# EAGLE schematic circuit_v2 (EAGLE 9.5.2)
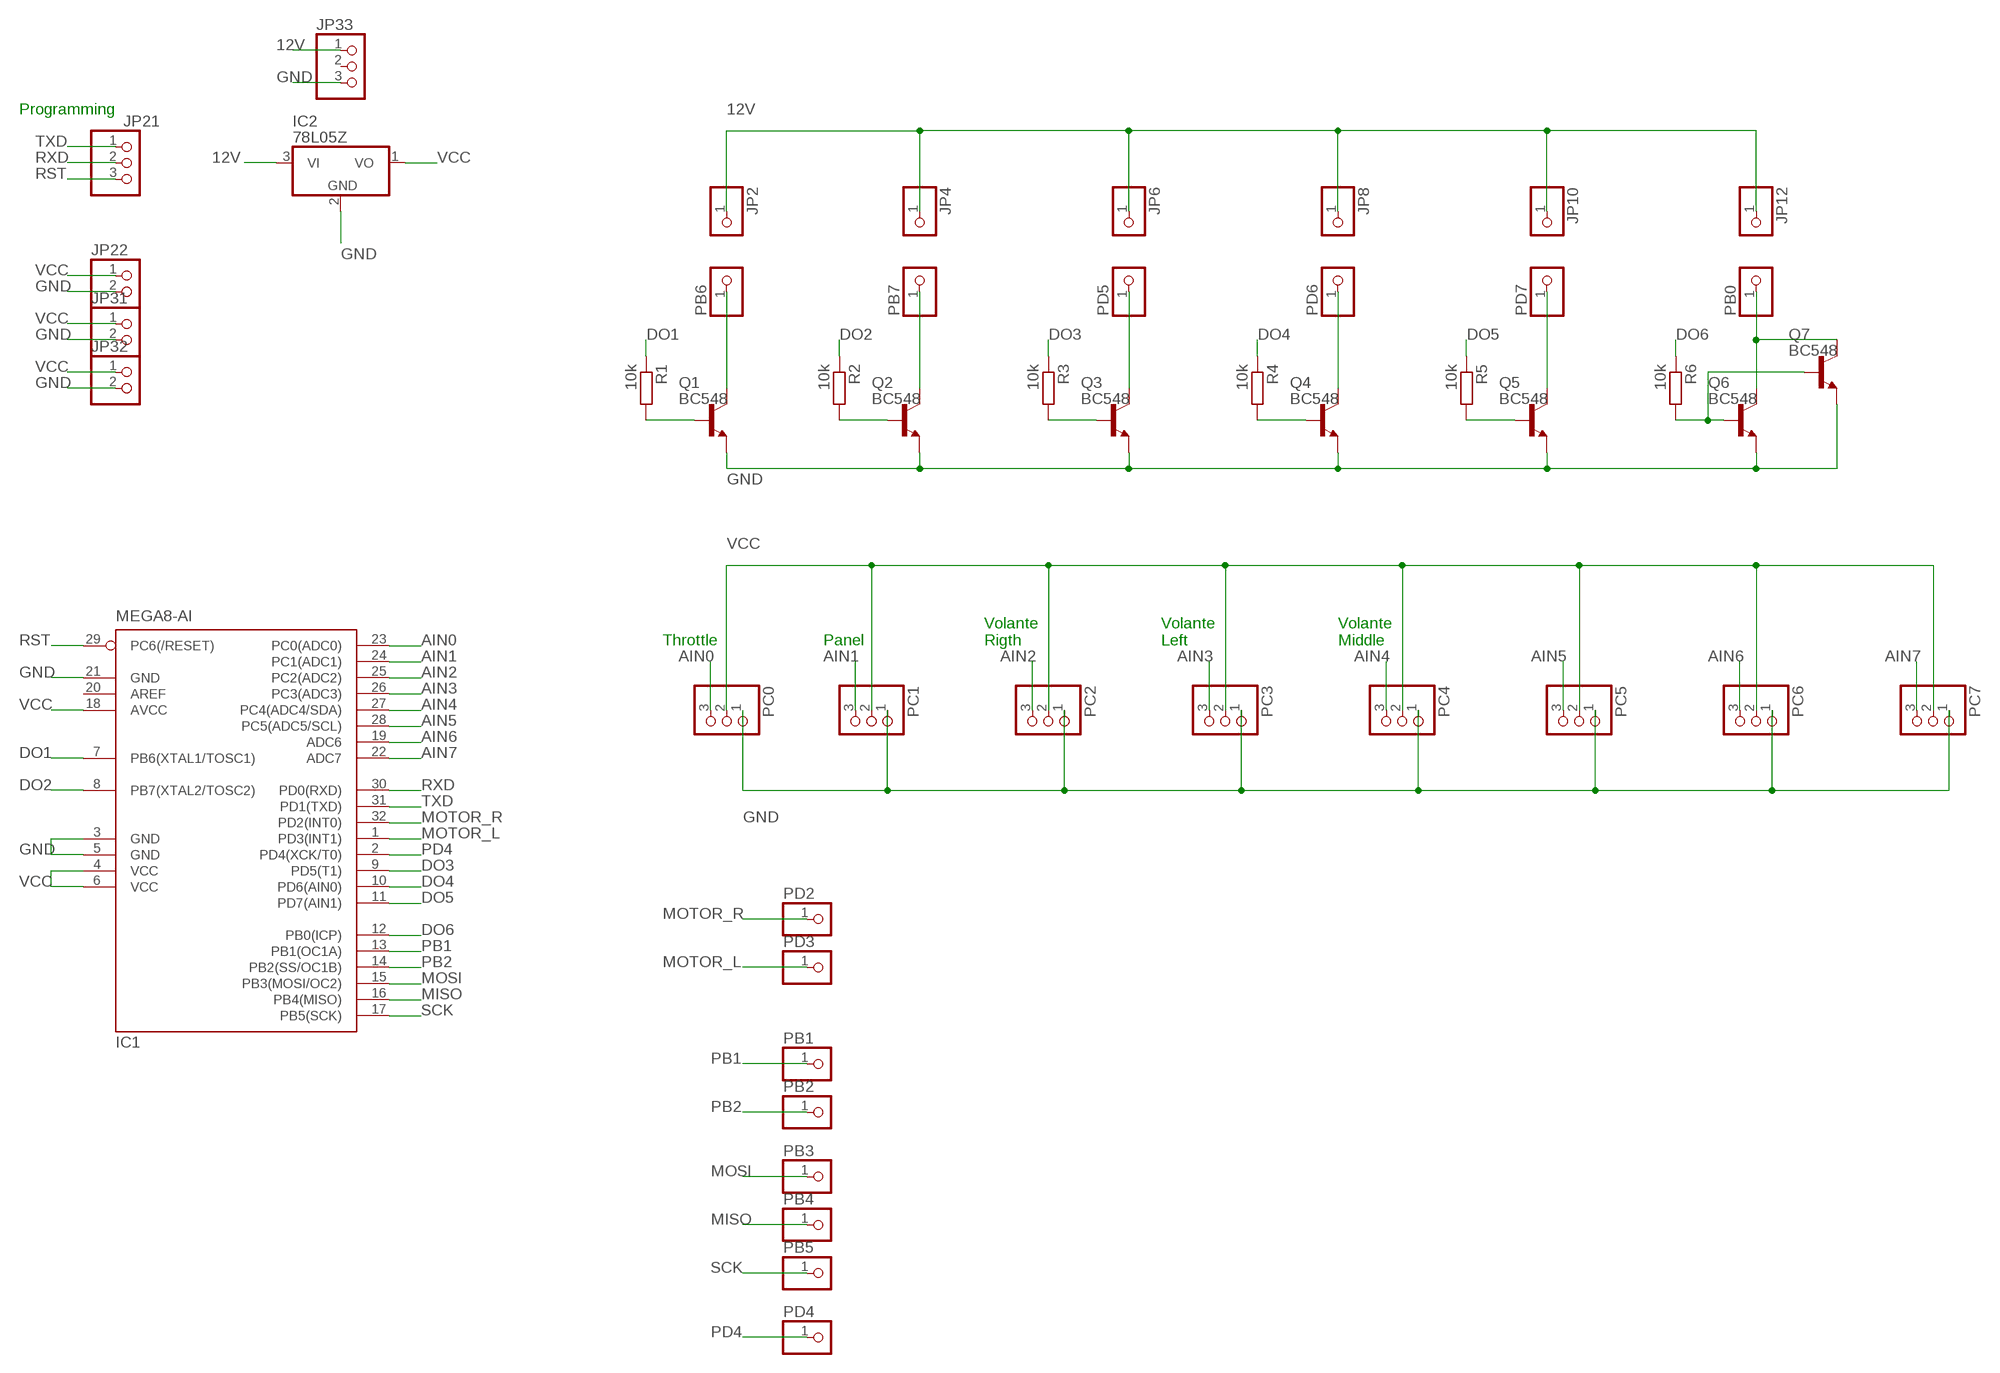
[diagram p0: schematic, sheet 1]

## Parts
IC1  MEGA8-AI  [TQFP32-08]
IC2  78L05Z  [TO92]
JP2  PINHD-1X1  [1X01]
JP4  PINHD-1X1  [1X01]
JP6  PINHD-1X1  [1X01]
JP8  PINHD-1X1  [1X01]
JP10  PINHD-1X1  [1X01]
JP12  PINHD-1X1  [1X01]
JP21  PINHD-1X3  [1X03]
JP22  PINHD-1X2  [1X02]
JP31  PINHD-1X2  [1X02]
JP32  PINHD-1X2  [1X02]
JP33  PINHD-1X3  [1X03]
PB0  PINHD-1X1  [1X01]
PB1  PINHD-1X1  [1X01]
PB2  PINHD-1X1  [1X01]
PB3  PINHD-1X1  [1X01]
PB4  PINHD-1X1  [1X01]
PB5  PINHD-1X1  [1X01]
PB6  PINHD-1X1  [1X01]
PB7  PINHD-1X1  [1X01]
PC0  PINHD-1X3  [1X03]
PC1  PINHD-1X3  [1X03]
PC2  PINHD-1X3  [1X03]
PC3  PINHD-1X3  [1X03]
PC4  PINHD-1X3  [1X03]
PC5  PINHD-1X3  [1X03]
PC6  PINHD-1X3  [1X03]
PC7  PINHD-1X3  [1X03]
PD2  PINHD-1X1  [1X01]
PD3  PINHD-1X1  [1X01]
PD4  PINHD-1X1  [1X01]
PD5  PINHD-1X1  [1X01]
PD6  PINHD-1X1  [1X01]
PD7  PINHD-1X1  [1X01]
Q1  BC548  [TO92-EBC]
Q2  BC548  [TO92-EBC]
Q3  BC548  [TO92-EBC]
Q4  BC548  [TO92-EBC]
Q5  BC548  [TO92-EBC]
Q6  BC548  [TO92-EBC]
Q7  BC548  [TO92-EBC]
R1  10k  R-EU_0207/10  [0207/10]
R2  10k  R-EU_0207/10  [0207/10]
R3  10k  R-EU_0207/10  [0207/10]
R4  10k  R-EU_0207/10  [0207/10]
R5  10k  R-EU_0207/10  [0207/10]
R6  10k  R-EU_0207/10  [0207/10]

## Nets
12V: IC2.3(VI) JP2.1 JP4.1 JP6.1 JP8.1 JP10.1 JP12.1 JP33.1
AIN0: IC1.23(PC0(ADC0)) PC0.3
AIN1: IC1.24(PC1(ADC1)) PC1.3
AIN2: IC1.25(PC2(ADC2)) PC2.3
AIN3: IC1.26(PC3(ADC3)) PC3.3
AIN4: IC1.27(PC4(ADC4/SDA)) PC4.3
AIN5: IC1.28(PC5(ADC5/SCL)) PC5.3
AIN6: IC1.19(ADC6) PC6.3
AIN7: IC1.22(ADC7) PC7.3
DO1: IC1.7(PB6(XTAL1/TOSC1)) R1.1
DO2: IC1.8(PB7(XTAL2/TOSC2)) R2.1
DO3: IC1.9(PD5(T1)) R3.1
DO4: IC1.10(PD6(AIN0)) R4.1
DO5: IC1.11(PD7(AIN1)) R5.1
DO6: IC1.12(PB0(ICP)) R6.1
GND: IC1.3(GND) IC1.5(GND) IC1.21(GND) IC2.2(GND) JP22.2 JP31.2 JP32.2 JP33.3 PC0.1 PC1.1 PC2.1 PC3.1 PC4.1 PC5.1 PC6.1 PC7.1 Q1.E Q2.E Q3.E Q4.E Q5.E Q6.E Q7.E
MISO: IC1.16(PB4(MISO)) PB4.1
MOSI: IC1.15(PB3(MOSI/OC2)) PB3.1
MOTOR_L: IC1.1(PD3(INT1)) PD3.1
MOTOR_R: IC1.32(PD2(INT0)) PD2.1
N$1: Q1.B R1.2
N$2: Q2.B R2.2
N$3: Q3.B R3.2
N$4: Q4.B R4.2
N$5: Q5.B R5.2
N$6: Q6.B Q7.B R6.2
OUT1: PB6.1 Q1.C
OUT2: PB7.1 Q2.C
OUT3: PD5.1 Q3.C
OUT4: PD6.1 Q4.C
OUT5: PD7.1 Q5.C
OUT6: PB0.1 Q6.C Q7.C
PB1: IC1.13(PB1(OC1A)) PB1.1
PB2: IC1.14(PB2(SS/OC1B)) PB2.1
PD4: IC1.2(PD4(XCK/T0)) PD4.1
RST: IC1.29(PC6(/RESET)) JP21.3
RXD: IC1.30(PD0(RXD)) JP21.2
SCK: IC1.17(PB5(SCK)) PB5.1
TXD: IC1.31(PD1(TXD)) JP21.1
VCC: IC1.4(VCC) IC1.6(VCC) IC1.18(AVCC) IC2.1(VO) JP22.1 JP31.1 JP32.1 PC0.2 PC1.2 PC2.2 PC3.2 PC4.2 PC5.2 PC6.2 PC7.2
Unconnected: IC1.20(AREF) JP33.2

## Notes on the sheet
- Programming
- Throttle | Panel
- Volante
  Rigth
- Volante
  Left
- Volante
  Middle

## Library data of the parts
IC1 = atmel:MEGA8: MICROCONTROLLER 8 Kbytes FLASH, 1 kbytes SRAM, 512 bytes EEPROM, USART, 6-channel 10 bit ADC, 2-channel 8 bit ADC Pin compatible with Atmega48, ATMega88, ATMega168 Source: avr.lbr; MPN: ATMEGA8-16AU; OC_FARNELL: 9171371; OC_NEWARK: 73M8863
IC2 = linear:78*: Positive VOLTAGE REGULATOR Source: http://cache.national.com/ds/LM/LM78L05.pdf http://www.fairchildsemi.com/ds/LM/LM7805.pdf
JP2 JP4 JP6 JP8 JP10 JP12 PB0 PB1-PB7 PD2-PD7 = pinhead:PINHD-1X1: PIN HEADER
JP21 JP33 PC0 PC1-PC7 = pinhead:PINHD-1X3: PIN HEADER
JP22 JP31 JP32 = pinhead:PINHD-1X2: PIN HEADER
Q1-Q7 = transistor-npn:BC548*: NPN Transistor
R1-R6 = rcl:R-EU_: RESISTOR, European symbol; SPICEPREFIX: R